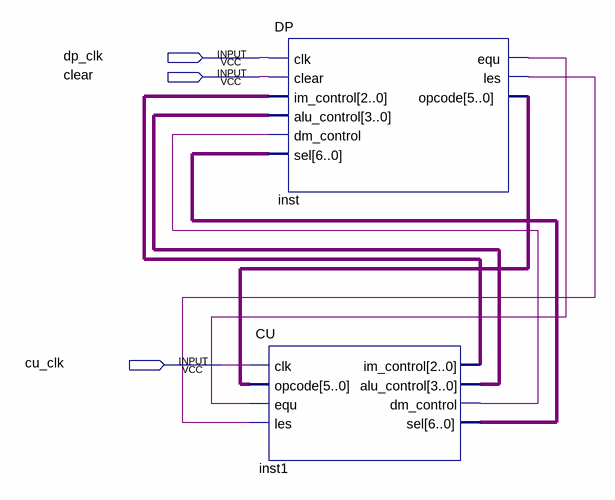
[diagram p0: schematic sheet]
// Quartus schematic CA_Project.bdf as structural Verilog: 2 symbols, 3 pins
module CA_Project (
  input  dp_clk,
  input  clear,
  input  cu_clk
);

  wire inst1_dm_control, inst_equ, inst_les;
  wire [2:0] inst1_im_control;
  wire [3:0] inst1_alu_control;
  wire [5:0] inst_opcode;
  wire [6:0] inst1_sel;

  DP inst (
    .clk(dp_clk), .clear(clear), .im_control(inst1_im_control), .alu_control(inst1_alu_control),
    .dm_control(inst1_dm_control), .sel(inst1_sel), .equ(inst_equ), .les(inst_les), .opcode(inst_opcode));
  CU inst1 (
    .clk(cu_clk), .opcode(inst_opcode), .equ(inst_equ), .les(inst_les), .im_control(inst1_im_control),
    .alu_control(inst1_alu_control), .dm_control(inst1_dm_control), .sel(inst1_sel));
endmodule
